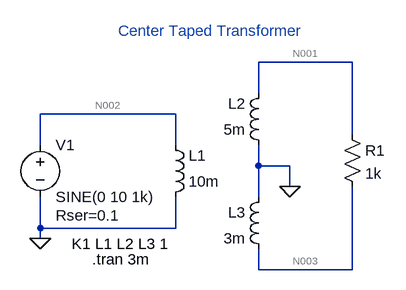
[diagram p0: schematic creating_center_tapped.asc]
creating_center_tapped.asc, the LTspice schematic file:
Version 4.1
SHEET 1 880 680
WIRE 480 -16 336 -16
WIRE 336 32 336 -16
WIRE 208 64 0 64
WIRE 480 96 480 -16
WIRE 0 112 0 64
WIRE 208 112 208 64
WIRE 336 144 336 112
WIRE 384 144 336 144
WIRE 384 176 384 144
WIRE 336 192 336 144
WIRE 0 240 0 192
WIRE 208 240 208 192
WIRE 208 240 0 240
WIRE 0 256 0 240
WIRE 336 304 336 272
WIRE 480 304 480 176
WIRE 480 304 336 304
FLAG 384 176 0
FLAG 0 256 0
SYMBOL voltage 0 96 R0
WINDOW 123 0 0 Left 0
WINDOW 39 24 124 Left 2
SYMATTR InstName V1
SYMATTR Value SINE(0 10 1k)
SYMATTR SpiceLine Rser=0.1
SYMBOL ind 192 208 M180
WINDOW 0 36 80 Left 2
WINDOW 3 36 40 Left 2
SYMATTR InstName L1
SYMATTR Value 10m
SYMATTR Type ind
SYMBOL ind 352 128 R180
WINDOW 0 36 80 Left 2
WINDOW 3 36 40 Left 2
SYMATTR InstName L2
SYMATTR Value 5m
SYMATTR Type ind
SYMBOL ind 352 176 M0
SYMATTR InstName L3
SYMATTR Value 3m
SYMATTR Type ind
SYMBOL res 464 80 R0
SYMATTR InstName R1
SYMATTR Value 1k
TEXT 48 264 Left 2 !K1 L1 L2 L3 1
TEXT 80 288 Left 2 !.tran 3m
TEXT 120 -64 Left 2 ;Center Taped Transformer

The netlist it stands for:
* creating_center_tapped.asc
V1 N002 0 SINE(0 10 1k) Rser=0.1
L1 0 N002 10m
L2 0 N001 5m
L3 0 N003 3m
R1 N001 N003 1k
K1 L1 L2 L3 1
.tran 3m
* Center Taped Transformer
.backanno
.end

* Results of the author's LTspice run, read from the files saved beside the schematic
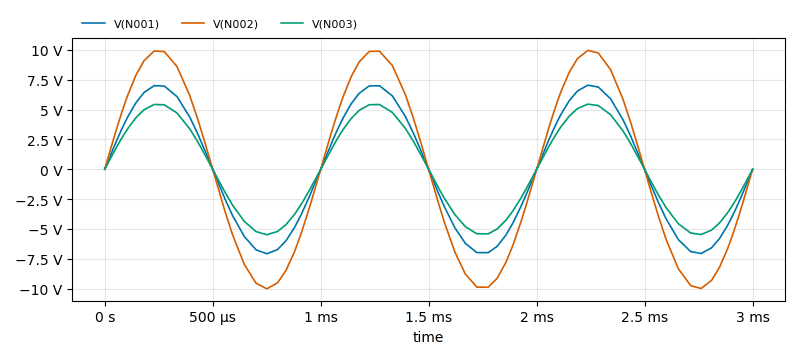
[diagram p1: Transient Analysis of creating_center_tapped.asc, plotted from the saved traces]
* Transient Analysis, 1 run:
*   V(N001): min -7.082 V, max 7.038 V, average -11.87 mV, rms 4.979 V, last 332.6 µV
*   V(N002): min -10.02 V, max 9.953 V, average -16.79 mV, rms 7.042 V, last 470.4 µV
*   V(N003): min -5.486 V, max 5.451 V, average -9.197 mV, rms 3.857 V, last 257.6 µV